# EAGLE design WatchMe-BASIC-TOP (EAGLE 9.6.2)
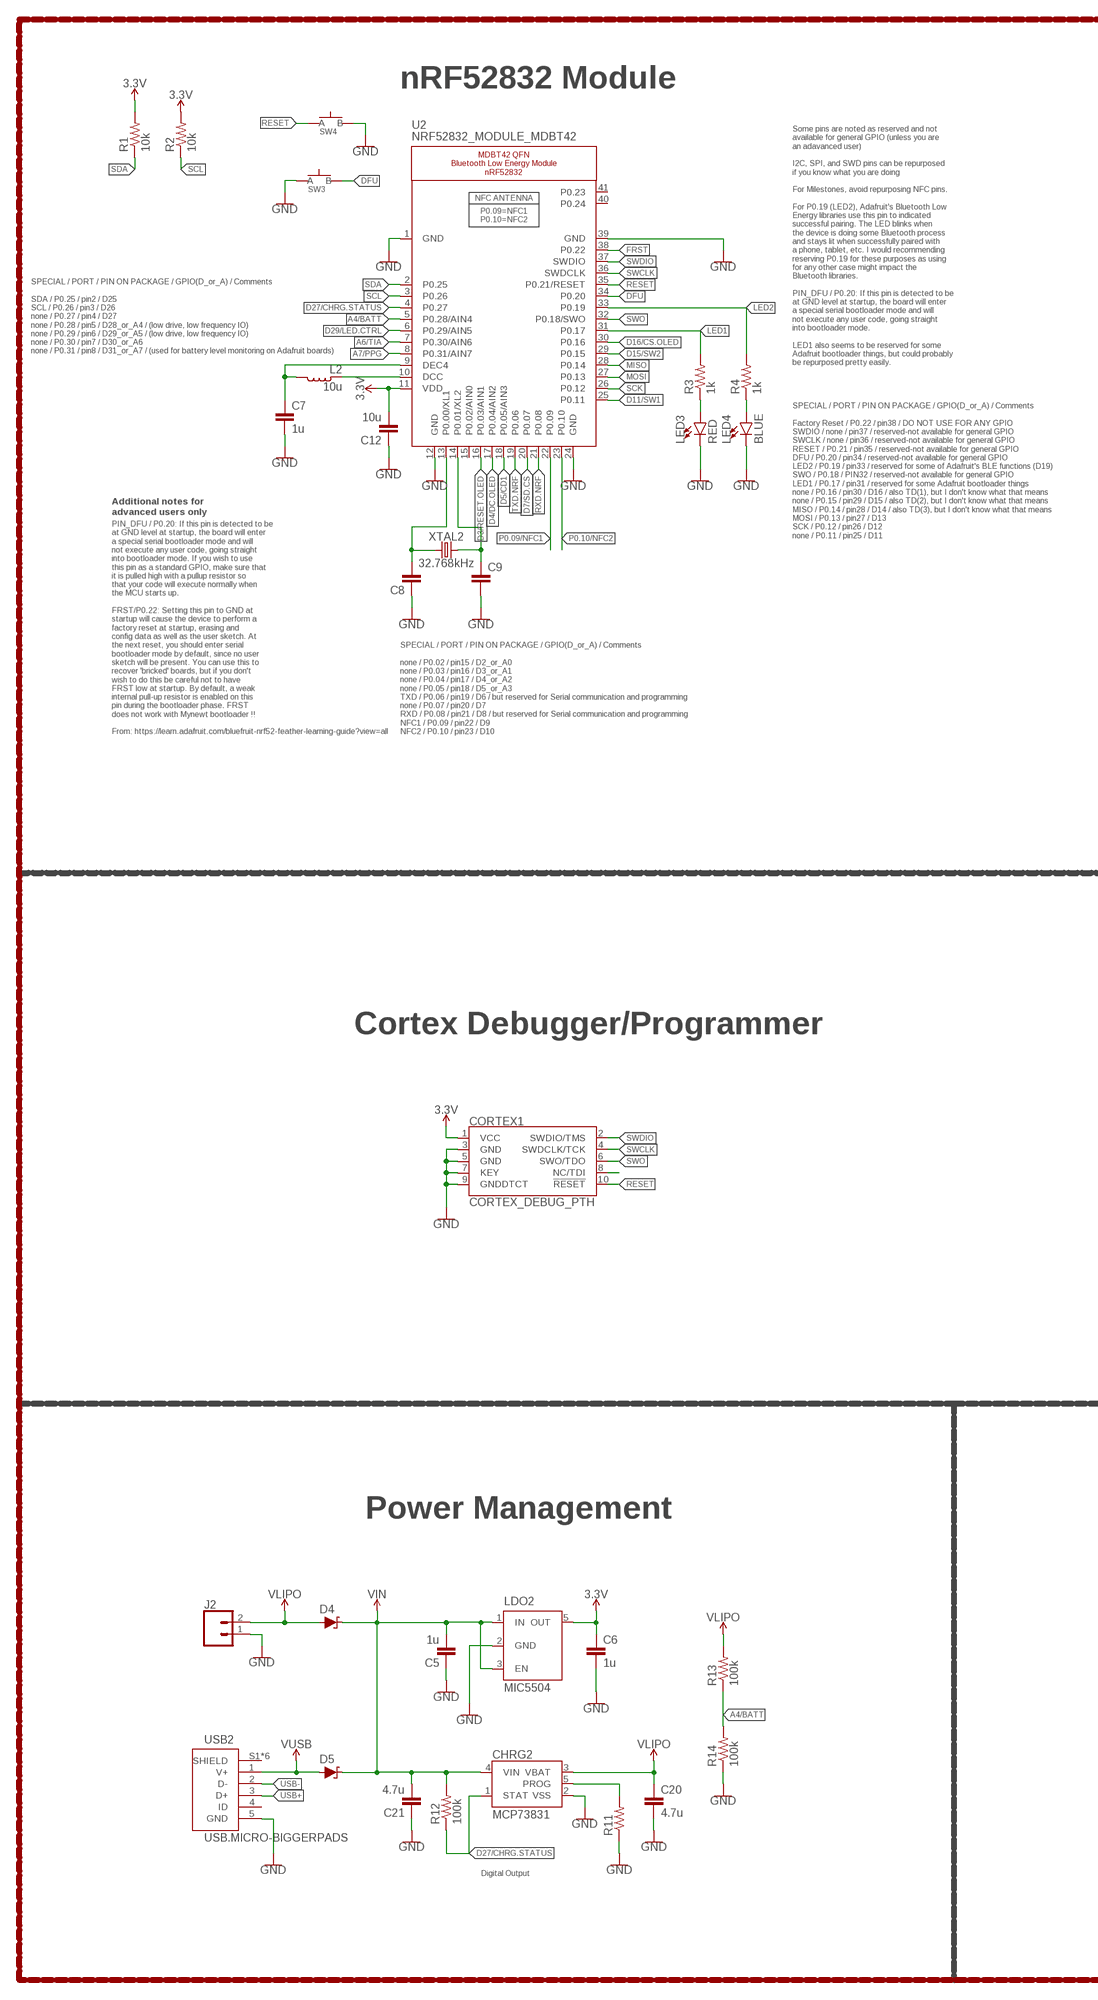
[diagram p0: schematic, sheet 1, part 1 of 2]
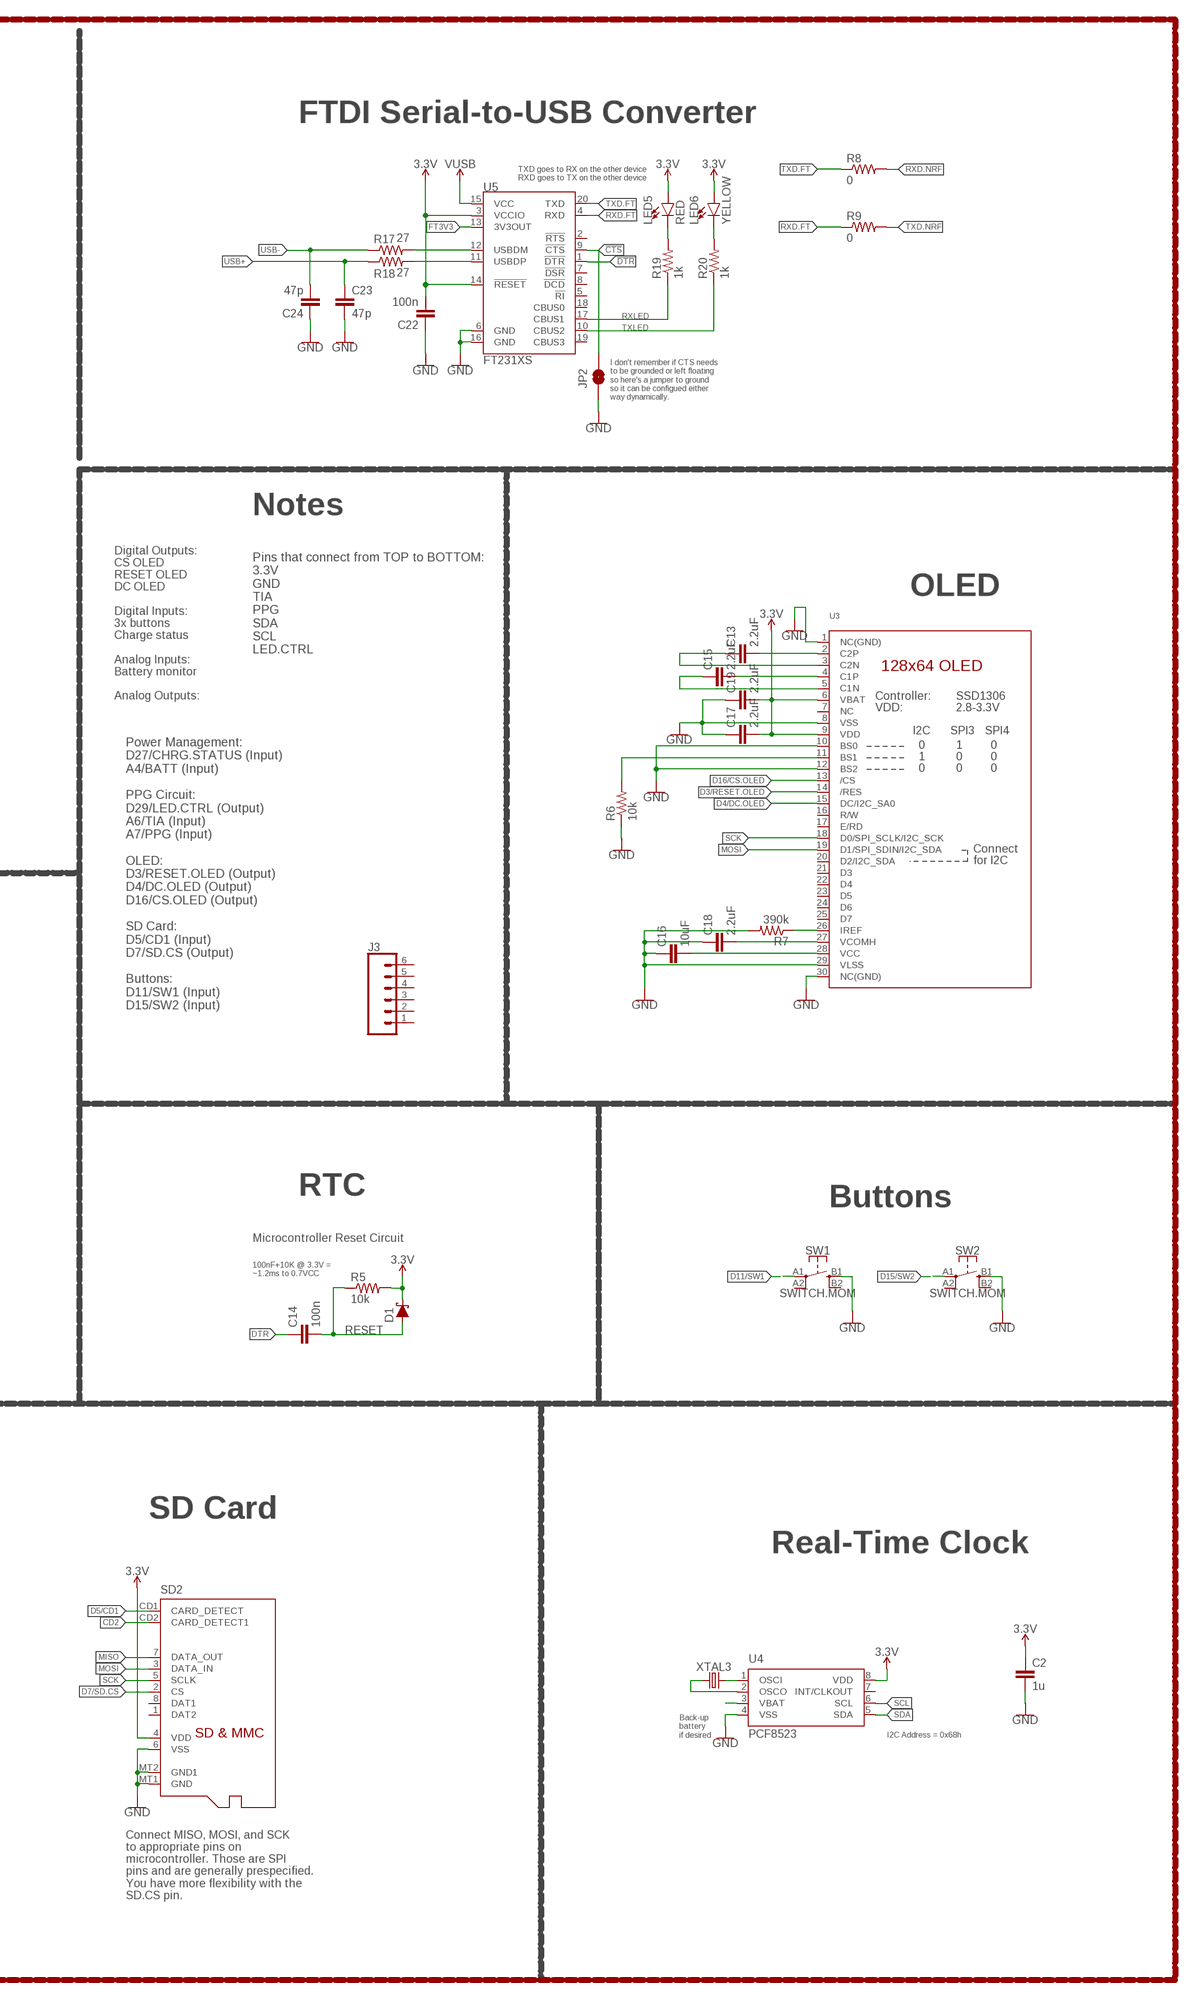
[diagram p1: schematic, sheet 1, part 2 of 2]

## Parts
C2  1u  CAPACITOR0603  [C0603]
C5  1u  CAPACITOR0603  [C0603]
C6  1u  CAPACITOR0603  [C0603]
C7  1u  CAPACITOR0603  [C0603]
C8  CAPACITOR0603  [C0603]
C9  CAPACITOR0603  [C0603]
C12  10u  CAPACITOR0805  [C0805]
C13  2.2uF  CAPACITOR0402  [C0402]
C14  100n  CAPACITOR0603  [C0603]
C15  2.2uF  CAPACITOR0402  [C0402]
C16  10uF  CAPACITOR0603  [C0603]
C17  2.2uF  CAPACITOR0402  [C0402]
C18  2.2uF  CAPACITOR0402  [C0402]
C19  2.2uF  CAPACITOR0402  [C0402]
C20  4.7u  CAPACITOR0603  [C0603]
C21  4.7u  CAPACITOR0603  [C0603]
C22  100n  CAPACITOR0603  [C0603]
C23  47p  CAPACITOR0603  [C0603]
C24  47p  CAPACITOR0603  [C0603]
CHRG2  MCP73831  [SOT23-5]
CORTEX1  CORTEX_DEBUG_PTH  [2X5-PTH-1.27MM]
D1  SCHOTTKY-USC  [USC]
D4  SCHOTTKY-USC  [USC]
D5  SCHOTTKY-USC  [USC]
J2  CONN_02  [1X02]
J3  CONN_061.27MM  [1X06_1.27MM]
JP2  JUMPER-SMT_2_NO_SILK  [SMT-JUMPER_2_NO_SILK]
L2  10u  INDUCTOR0603  [L0603]
LDO2  MIC5504  [SOT23-5]
LED3  RED  LED0603  [LED-0603]
LED4  BLUE  LED0603  [LED-0603]
LED5  RED  LED0603  [LED-0603]
LED6  YELLOW  LED0603  [LED-0603]
R1  10k  RESISTOR0603  [R0603]
R2  10k  RESISTOR0603  [R0603]
R3  1k  RESISTOR0603  [R0603]
R4  1k  RESISTOR0603  [R0603]
R5  10k  RESISTOR0603  [R0603]
R6  10k  RESISTOR0603  [R0603]
R7  390k  RESISTOR0603  [R0603]
R8  0  RESISTOR0603  [R0603]
R9  0  RESISTOR0603  [R0603]
R11  RESISTOR0603  [R0603]
R12  100k  RESISTOR0603  [R0603]
R13  100k  RESISTOR0603  [R0603]
R14  100k  RESISTOR0603  [R0603]
R17  27  RESISTOR0603  [R0603]
R18  27  RESISTOR0603  [R0603]
R19  1k  RESISTOR0603  [R0603]
R20  1k  RESISTOR0603  [R0603]
SD2  MICROSD  [MICROSD]
SW1  SWITCH.MOM  [TACTILE_SWITCH_SMD_6.2MM_TALL]
SW2  SWITCH.MOM  [TACTILE_SWITCH_SMD_6.2MM_TALL]
SW3  SPST-PTS830GG140-COPY.1-3  [BUTTON-GULLWING]
SW4  SPST-PTS830GG140-COPY.1-3  [BUTTON-GULLWING]
U2  NRF52832_MODULE_MDBT42  [BLE_MODULE_RAYTAC_MDBT42]
U3  DISP_OLED_UG-2864HSWEG01-NO-WRAPAROUND  [UG-2864HSWEG01_0.96IN_NO-WRAPAROUND]
U4  PCF8523  [SO8]
U5  FT231XS  [SSOP20_L]
USB2  USB.MICRO-BIGGERPADS  [USB-MICRO-01.BIGGERPADS]
XTAL2  32.768kHz  CRYSTALECS-.327-12.5-12-C-TR  [2-SMD.NOLEAD.2.0MMTO1.2MM]
XTAL3  32.7680kHz  CRYSTALECS-.327-12.5-12-C-TR  [2-SMD.NOLEAD.2.0MMTO1.2MM]

## Nets
3.3V: C2.1 C6.1 C12.2 C17.2 C19.2 C22.2 CORTEX1.1(VCC) D1.-(C) LDO2.5(OUT) LED5.A LED6.A R1.2 R2.2 R5.2 SD2.4(VDD) U2.11(VDD) U3.6(VBAT) U3.9(VDD) U4.8(VDD) U5.3(VCCIO) U5.14(!RESET)
!CTS: JP2.2 U5.9(!CTS)
!DTR: U5.1(!DTR)
A4/BATT: R13.1 R14.2 U2.5(P0.28/AIN4)
A6/TIA: U2.7(P0.30/AIN6)
A7/PPG: U2.8(P0.31/AIN7)
CD2: SD2.CD2(CARD_DETECT1)
D3/RESET.OLED: U2.16(P0.03/AIN1) U3.14(/RES)
D4/DC.OLED: U2.17(P0.04/AIN2) U3.15(DC/I2C_SA0)
D5/CD1: SD2.CD1(CARD_DETECT) U2.18(P0.05/AIN3)
D7/SD.CS: SD2.2(CS) U2.20(P0.07)
D11/SW1: SW1.A1 U2.25(P0.11)
D15/SW2: SW2.A1 U2.29(P0.15)
D16/CS.OLED: U2.30(P0.16) U3.13(/CS)
D27/CHRG.STATUS: CHRG2.1(STAT) R12.1 U2.4(P0.27)
D29/LED.CTRL: U2.6(P0.29/AIN5)
DFU: SW3.3(B) U2.34(P0.20)
DTR: C14.1
FRST: U2.38(P0.22)
FT3V3: U5.13(3V3OUT)
GND: C2.2 C5.1 C6.2 C7.2 C8.1 C9.2 C12.1 C16.1 C17.1 C18.1 C19.1 C20.2 C21.1 C22.1 C23.2 C24.1 CHRG2.2(VSS) CORTEX1.3(GND) CORTEX1.5(GND) CORTEX1.7(KEY) CORTEX1.9(GNDDTCT) J2.1 JP2.1 LDO2.2(GND) LED3.C LED4.C R6.1 R7.2 R11.1 R14.1 SD2.6(VSS) SD2.MT1(GND) SD2.MT2(GND1) SW1.B1 SW2.B1 SW3.1(A) SW4.3(B) U2.1(GND) U2.12(GND) U2.24(GND) U2.39(GND) U3.1(NC(GND)) U3.8(VSS) U3.10(BS0) U3.12(BS2) U3.29(VLSS) U3.30(NC(GND)) U4.4(VSS) U5.6(GND) U5.16(GND) USB2.5(GND)
LED1: R3.2 U2.31(P0.17)
LED2: R4.2 U2.33(P0.19)
MISO: SD2.7(DATA_OUT) U2.28(P0.14)
MOSI: SD2.3(DATA_IN) U2.27(P0.13) U3.19(D1/SPI_SDIN/I2C_SDA)
N$1: R6.2 U3.11(BS1)
N$2: R7.1 U3.26(IREF)
N$3: C13.2 U3.2(C2P)
N$4: C8.2 U2.13(P0.00/XL1) XTAL2.P$1
N$5: C13.1 U3.3(C2N)
N$6: C9.1 U2.14(P0.01/XL2) XTAL2.P$2
N$7: C15.2 U3.4(C1P)
N$8: C15.1 U3.5(C1N)
N$9: LED3.A R3.1
N$10: LED4.A R4.1
N$11: L2.1 U2.10(DCC)
N$12: C7.1 L2.2 U2.9(DEC4)
N$13: C16.2 U3.28(VCC)
N$14: CORTEX1.8(NC/TDI)
N$15: C18.2 U3.27(VCOMH)
N$17: CHRG2.5(PROG) R11.2
N$19: U4.2(OSCO) XTAL3.P$1
N$20: U4.1(OSCI) XTAL3.P$2
N$23: R17.2 U5.12(USBDM)
N$24: R18.2 U5.11(USBDP)
N$25: LED5.C R19.2
N$26: LED6.C R20.2
P0.09/NFC1: U2.22(P0.09)
P0.10/NFC2: U2.23(P0.10)
RESET: C14.2 CORTEX1.10(!RESET) D1.+(A) R5.1 SW4.1(A) U2.35(P0.21/RESET)
RXD.FT: R9.1 U5.4(RXD)
RXD.NRF: R8.2 U2.21(P0.08)
RXLED: R19.1 U5.17(CBUS1)
SCK: SD2.5(SCLK) U2.26(P0.12) U3.18(D0/SPI_SCLK/I2C_SCK)
SCL: R2.1 U2.3(P0.26) U4.6(SCL)
SDA: R1.1 U2.2(P0.25) U4.5(SDA)
SWCLK: CORTEX1.4(SWDCLK/TCK) U2.36(SWDCLK)
SWDIO: CORTEX1.2(SWDIO/TMS) U2.37(SWDIO)
SWO: CORTEX1.6(SWO/TDO) U2.32(P0.18/SWO)
TXD.FT: R8.1 U5.20(TXD)
TXD.NRF: R9.2 U2.19(P0.06)
TXLED: R20.1 U5.10(CBUS2)
USB+: C23.1 R18.1 USB2.3(D+)
USB-: C24.2 R17.1 USB2.2(D-)
V_USB: D5.+(A) U5.15(VCC) USB2.1(V+) ; supply symbol labelled VUSB
VBATT: U4.3(VBAT)
VIN: C5.2 C21.2 CHRG2.4(VIN) D4.-(C) D5.-(C) LDO2.1(IN) LDO2.3(EN) R12.2
VLIPO: C20.1 CHRG2.3(VBAT) D4.+(A) J2.2 R13.2
Unconnected: J3.1 J3.2 J3.3 J3.4 J3.5 J3.6 SD2.1(DAT2) SD2.8(DAT1) SW1.A2 SW1.B2 SW2.A2 SW2.B2 U2.15(P0.02/AIN0) U2.40(P0.24) U2.41(P0.23) U3.7(NC) U3.16(R/W) U3.17(E/RD) U3.20(D2/I2C_SDA) U3.21(D3) U3.22(D4) U3.23(D5) U3.24(D6) U3.25(D7) U4.7(INT/CLKOUT) U5.2(!RTS) U5.5(!RI) U5.7(!DSR) U5.8(!DCD) U5.18(CBUS0) U5.19(CBUS3) USB2.4(ID) USB2.S1(SHIELD) USB2.S2(SHIELD) USB2.S3(SHIELD) USB2.S4(SHIELD) USB2.S5(SHIELD) USB2.S6(SHIELD)

## Notes on the sheet
- nRF52832 Module
- FTDI Serial-to-USB Converter
- TXD goes to RX on the other device
  RXD goes to TX on the other device
- SPECIAL / PORT / PIN ON PACKAGE / GPIO(D_or_A) / Comments
  
  SDA / P0.25 / pin2 / D25
  SCL / P0.26 / pin3 / D26
  none / P0.27 / pin4 / D27
  none / P0.28 / pin5 / D28_or_A4 / (low drive, low frequency IO)
  none / P0.29 / pin6 / D29_or_A5 / (low drive, low frequency IO)
  none / P0.30 / pin7 / D30_or_A6
  none / P0.31 / pin8 / D31_or_A7 / (used for battery level monitoring on Adafruit boards)
- Some pins are noted as reserved and not
  available for general GPIO (unless you are
  an adavanced user)
  
  I2C, SPI, and SWD pins can be repurposed
  if you know what you are doing
  
  For Milestones, avoid repurposing NFC pins.
  
  For P0.19 (LED2), Adafruit's Bluetooth Low
  Energy libraries use this pin to indicated
  successful pairing. The LED blinks when
  the device is doing some Bluetooth process
  and stays lit when successfully paired with
  a phone, tablet, etc. I would recommending
  reserving P0.19 for these purposes as using
  for any other case might impact the
  Bluetooth libraries.
  
  PIN_DFU / P0.20: If this pin is detected to be
  at GND level at startup, the board will enter
  a special serial bootloader mode and will
  not execute any user code, going straight
  into bootloader mode.
  
  LED1 also seems to be reserved for some
  Adafruit bootloader things, but could probably
  be repurposed pretty easily.
- I don't remember if CTS needs
  to be grounded or left floating
  so here's a jumper to ground
  so it can be configued either
  way dynamically.
- Additional notes for
  advanced users only
- Notes
- SPECIAL / PORT / PIN ON PACKAGE / GPIO(D_or_A) / Comments
  
  Factory Reset / P0.22 / pin38 / DO NOT USE FOR ANY GPIO
  SWDIO / none / pin37 / reserved-not available for general GPIO
  SWCLK / none / pin36 / reserved-not available for general GPIO
  RESET / P0.21 / pin35 / reserved-not available for general GPIO
  DFU / P0.20 / pin34 / reserved-not available for general GPIO
  LED2 / P0.19 / pin33 / reserved for some of Adafruit's BLE functions (D19)
  SWO / P0.18 / PIN32 / reserved-not available for general GPIO
  LED1 / P0.17 / pin31 / reserved for some Adafruit bootloader things
  none / P0.16 / pin30 / D16 / also TD(1), but I don't know what that means
  none / P0.15 / pin29 / D15 / also TD(2), but I don't know what that means
  MISO / P0.14 / pin28 / D14 / also TD(3), but I don't know what that means
  MOSI / P0.13 / pin27 / D13
  SCK / P0.12 / pin26 / D12
  none / P0.11 / pin25 / D11
- OLED
- Pins that connect from TOP to BOTTOM:
  3.3V
  GND
  TIA
  PPG
  SDA
  SCL
  LED.CTRL
- Digital Outputs:
  CS OLED
  RESET OLED
  DC OLED
  
  Digital Inputs:
  3x buttons
  Charge status
  
  Analog Inputs:
  Battery monitor
  
  Analog Outputs:
- PIN_DFU / P0.20: If this pin is detected to be
  at GND level at startup, the board will enter
  a special serial bootloader mode and will
  not execute any user code, going straight
  into bootloader mode. If you wish to use
  this pin as a standard GPIO, make sure that
  it is pulled high with a pullup resistor so
  that your code will execute normally when
  the MCU starts up.
  
  FRST/P0.22: Setting this pin to GND at
  startup will cause the device to perform a
  factory reset at startup, erasing and
  config data as well as the user sketch. At
  the next reset, you should enter serial
  bootloader mode by default, since no user
  sketch will be present. You can use this to
  recover 'bricked' boards, but if you don't
  wish to do this be careful not to have
  FRST low at startup. By default, a weak
  internal pull-up resistor is enabled on this
  pin during the bootloader phase. FRST
  does not work with Mynewt bootloader !!
  
  From: https://learn.adafruit.com/bluefruit-nrf52-feather-learning-guide?view=all
- SPECIAL / PORT / PIN ON PACKAGE / GPIO(D_or_A) / Comments
  
  none / P0.02 / pin15 / D2_or_A0
  none / P0.03 / pin16 / D3_or_A1
  none / P0.04 / pin17 / D4_or_A2
  none / P0.05 / pin18 / D5_or_A3
  TXD / P0.06 / pin19 / D6 / but reserved for Serial communication and programming
  none / P0.07 / pin20 / D7
  RXD / P0.08 / pin21 / D8 / but reserved for Serial communication and programming
  NFC1 / P0.09 / pin22 / D9
  NFC2 / P0.10 / pin23 / D10
- Power Management:
  D27/CHRG.STATUS (Input)
  A4/BATT (Input)
  
  PPG Circuit:
  D29/LED.CTRL (Output)
  A6/TIA (Input)
  A7/PPG (Input)
  
  OLED:
  D3/RESET.OLED (Output)
  D4/DC.OLED (Output)
  D16/CS.OLED (Output)
  
  SD Card:
  D5/CD1 (Input)
  D7/SD.CS (Output)
  
  Buttons:
  D11/SW1 (Input)
  D15/SW2 (Input)
- Cortex Debugger/Programmer
- RTC
- Buttons
- Microcontroller Reset Circuit
- 100nF+10K @ 3.3V =
  ~1.2ms to 0.7VCC
- Power Management | SD Card
- Real-Time Clock
- Back-up
  battery
  if desired
- I2C Address = 0x68h
- Digital Output
- Connect MISO, MOSI, and SCK
  to appropriate pins on
  microcontroller. Those are SPI
  pins and are generally prespecified.
  You have more flexibility with the
  SD.CS pin.

## Library data of the parts
C2 C5-C9 C12-C24 = LinnesLab-Passives:CAPACITOR
CHRG2 = LinnesLab-Power:MCP73831: MCP73831T Li-Ion, Li-Pol Controller Miniature single cell, fully integrated Li-Ion, Li-polymer charge management controller Datasheet <http://ww1.microchip.com/downloads/en/DeviceDoc/20001984g.pdf> SparkFun Products: SparkFun ESP32 Thing <https://www.sparkfun.com/products/13907> SparkFun 9DoF Razor IMU M0 <https://www.sparkfun.com/products/14001>; PROD_ID: IC-09995
CORTEX1 = LinnesLab-Connectors:CORTEX_DEBUG: Cortex Debug Connector - 10 pin Supports JTAG debug, Serial Wire debug, and Serial Wire Viewer. PTH and SMD connector options available. General Connector Information <http://infocenter.arm.com/help/topic/com.arm.doc.faqs/attached/13634/cortex_debug_connectors.pdf> Products: PTH Connector <http://www.digikey.com/product-detail/en/cnc-tech/3220-10-0100-00/1175-1627-ND/3883661> -via Digi-Key SparkFun PSoc <https://www.sparkfun.com/products/13229> SparkFun T <https://www.sparkfun.com/products/13810>
D1 D4 D5 = LinnesLab-DiscreteSemi:SCHOTTKY: Schottky diode A Schottky diode is a semiconductor diode which has a low forward voltage drop and a very fast switching action. Example: Digi-Key Part Number: RB161MM-20CT-ND
J2 = LinnesLab-Connectors:CONN_02: Multi connection point. Often used as Generic Header-pin footprint for 0.1 inch spaced/style header connections On any of the 0.1 inch spaced packages, you can populate with these: Break Away Headers - Straight (PRT-00116) Break Away Male Headers - Right Angle (PRT-00553) Female Headers (PRT-00115) Break Away Headers - Machine Pin (PRT-00117) Break Away Female Headers - Swiss Machine Pin (PRT-00743) For SCREWTERMINALS and SPRING TERMINALS visit here: Screw Terimnals on SparkFun.com (5mm/3.5mm/2.54mm spacing) This device is also useful as a general connection point to wire up your design to another part of your project. Our various solder wires solder well into these plated through hole pads. Hook-Up Wire - Assortment (Stranded, 22 AWG) (PRT-11375) Hook-Up Wire - Assortment (Solid Core, 22 AWG) (PRT-11367) View the entire wire category on our website here Special notes: Molex polarized connector foot print use with: PRT-08233 with associated crimp pins and housings. 2.54_SCREWTERM for use with PRT-10571. 3.5mm Screw Terminal footprints for PRT-08084 5mm Screw Terminal footprints for use with PRT-08432
J3 = LinnesLab-Connectors:CONN_06: Multi connection point. Often used as Generic Header-pin footprint for 0.1 inch spaced/style header connections On any of the 0.1 inch spaced packages, you can populate with these: Break Away Headers - Straight (PRT-00116) Break Away Male Headers - Right Angle (PRT-00553) Female Headers (PRT-00115) Break Away Headers - Machine Pin (PRT-00117) Break Away Female Headers - Swiss Machine Pin (PRT-00743) Arduino Stackable Header - 6 Pin (PRT-09280) For SCREWTERMINALS and SPRING TERMINALS visit here: Screw Terimnals on SparkFun.com (5mm/3.5mm/2.54mm spacing) This device is also useful as a general connection point to wire up your design to another part of your project. Our various solder wires solder well into these plated through hole pads. Hook-Up Wire - Assortment (Stranded, 22 AWG) (PRT-11375) Hook-Up Wire - Assortment (Solid Core, 22 AWG) (PRT-11367) View the entire wire category on our website here
JP2 = LinnesLab-Switches:JUMPER-SMT_2_NO: Normally open jumper This jumper has two pads in close proximity to each other. Apply solder to close the connection. Round pads are easier to solder for beginners, but are a lot larger. SparkFun Product that uses the round pads: SparkFun EL Sequencer
L2 = LinnesLab-Passives:INDUCTOR
LDO2 = LinnesLab-Power:MIC5504: MIC5504 Voltage Regulator Output Voltages: 1.0V to 3.3V Input Voltages: 2.5V to 5.5V Link to Datasheet http://ww1.microchip.com/downloads/en/DeviceDoc/MIC550X.pdf
LED3-LED6 = LinnesLab-LED:LED: LED (Generic) Standard schematic elements and footprints for 5mm, 3mm, 1206, and 0603 sized LEDs. Generic LEDs with no color specified. LTST-C190KGKT: arrow indicates cathode
R1-R9 R11-R14 R17-R20 = LinnesLab-Passives:RESISTOR
SD2 = LinnesLab-Connectors:MICROSD: Micro-SD / Transflash card holder with SPI pinout For the 3M # 2908-05WB-MG and/or 4UCON #19656 push-push type
SW1 SW2 = LinnesLab-Switches:SWITCH.MOM: PTS645SM43SMTR92 LFS
SW3 SW4 = LinnesLab-Switches:SPST-PTS830GG140-COPY
U2 = LinnesLab-Microcontrollers:NRF52832_MODULE_MDBT42: MDBT42 - BLE Module (nRF52832 QFN) VDD: 1.7-3.6V
U3 = LinnesLab-Displays:DISP_OLED_UG-2864HSWEG01: UG-2864HSWEG01 OLED display Both 1.3" and 0.96" models share the same FPC tab footprint, only the screen dimensions vary.
U4 = LinnesLab-Clocks:PCF8523; DIGIKEY: 568-5306-1-ND; I2C_ADDRESS: 0x68h; MFN: PCF8523T/1,118; MFN_MANUFACTURER: NXP USA Inc.
U5 = LinnesLab-DigitalIC:FT231X: FTDI FT231X Full Speed USB to Full-handshake UART This USB2.0 Full Speed IC offers a compact bridge to full handshake UART interfaces. The device is a UART, capable of operating up to 3MBaud, with low power consumption (8mA). The FT231X includes the complete FT-X series feature set and enables USB to be added into a system design quickly and easily over a UART interface. Datasheet; DIGIKEY: 768-1156-5-ND; MFN: FT231XS-U
USB2 = LinnesLab-Connectors:USB.MICRO: DigiKey PN: 609-4613-1-ND
XTAL2 XTAL3 = LinnesLab-Clocks:CRYSTAL; DIGIKEY: XC2288CT-ND; FREQ: 32.7680KHZ; LOAD_CAP: 12.5pF

## Board
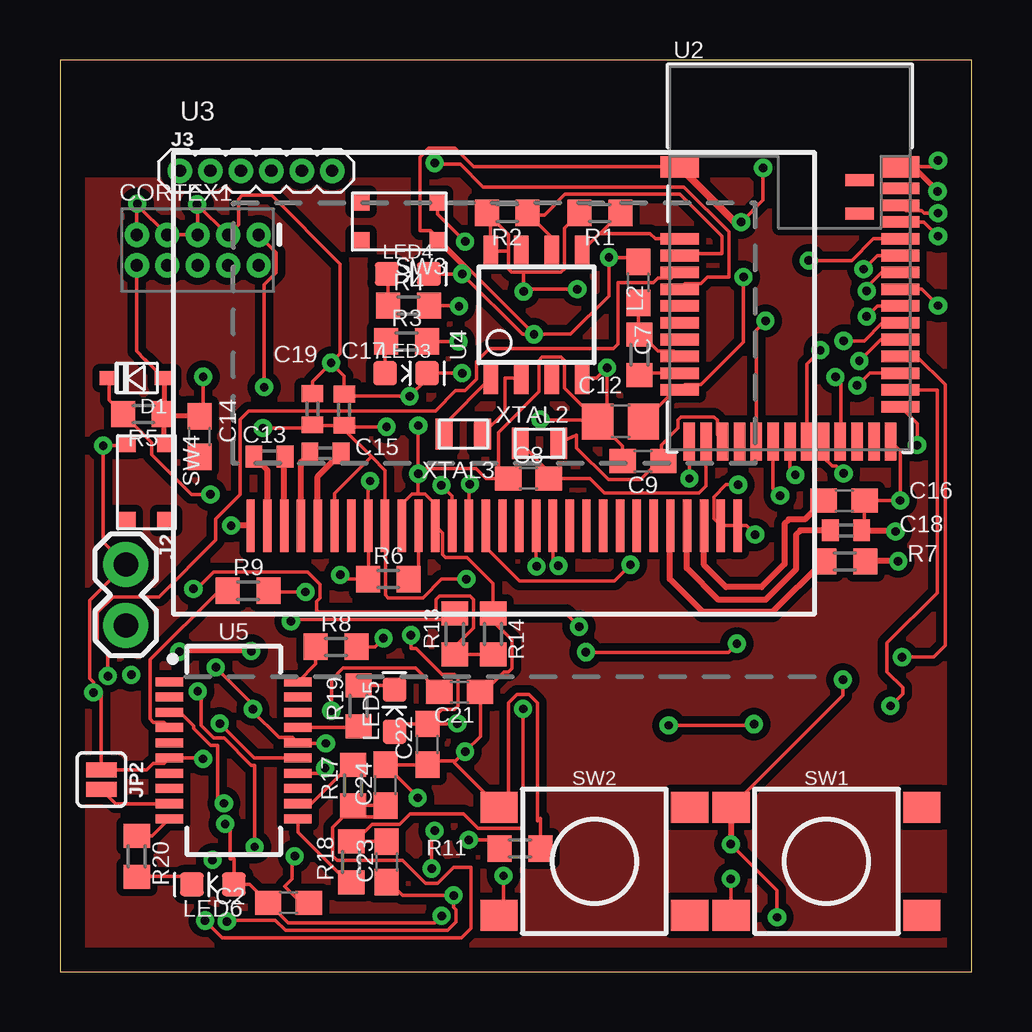
[diagram p2: board, top side]
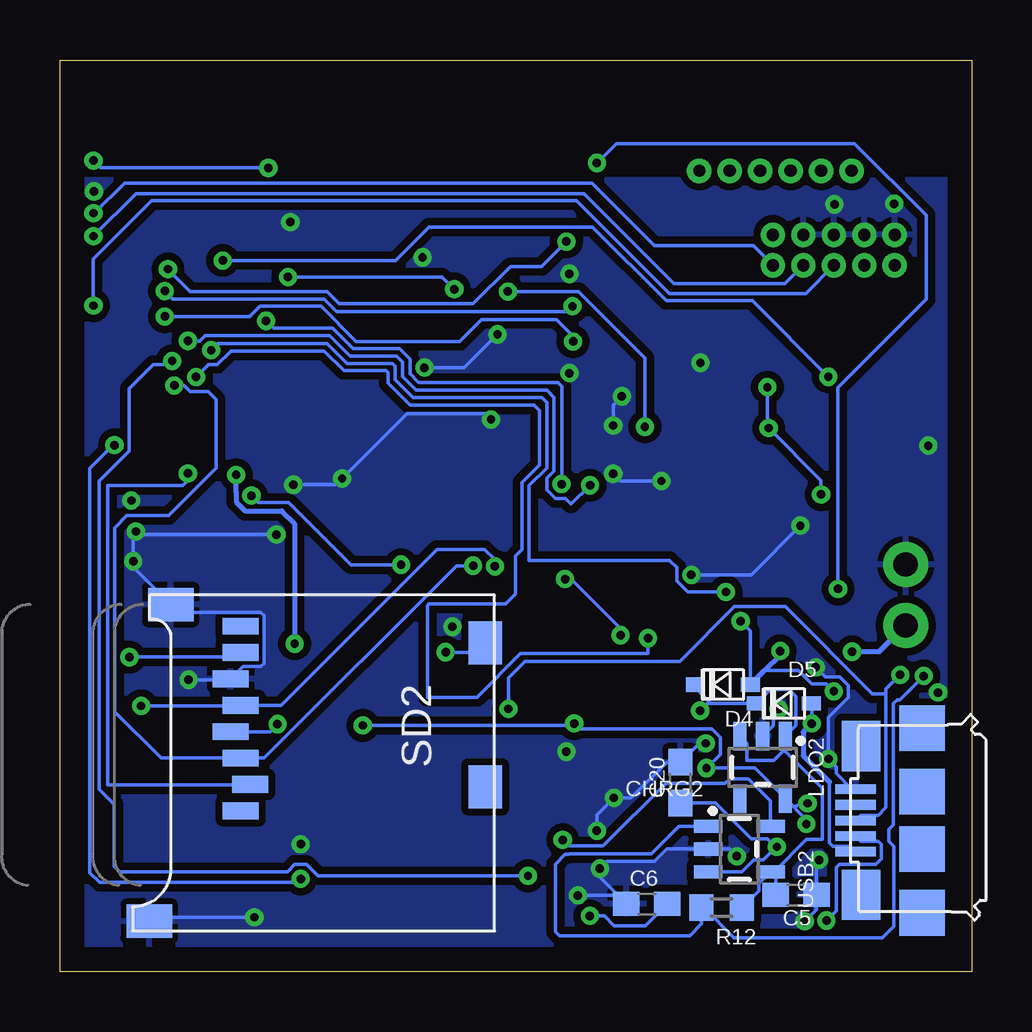
[diagram p3: board, bottom side, seen from below]

Size 38 x 38 mm. Coordinates in mm from the lower left corner, seen from the top.
Outline: 0,0 38,0 38,38 0,38 0,0
Copper layers (1*16): Top 0.035mm / dielectric 1.5mm / Bottom 0.035mm
Design rules "default": minimum track width 6mil, minimum drill 0.35mm, track to track 6mil, track to pad 6mil, pad to pad 6mil, via to via 6mil, smd to smd 6mil, copper to edge 40mil, drill to drill 6mil, minimum pad ring 10mil, minimum via ring 8mil, stop-mask expansion 4mil, vias tented up to drill 0mil, thermal gap 10mil

### Footprints (pad centres in the part's own frame; a part is rotated, then mirrored left to right if it is on the bottom)
C0603 = smd 1.1 x 1: 1 -0.85,0; 2 0.85,0
C0805 = smd 1.3 x 1.5: 1 -0.95,0; 2 0.95,0
C0402 = smd 0.7 x 0.9: 1 -0.65,0; 2 0.65,0
SOT23-5 = smd 0.55 x 1.2: 1 -0.95,-1.3; 2 0,-1.3; 3 0.95,-1.3; 4 0.95,1.3; 5 -0.95,1.3
2X5-PTH-1.27MM = drill 0.508 pad 1: 1 -2.54,-0.635; 2 -2.54,0.635; 3 -1.27,-0.635; 4 -1.27,0.635; 5 0,-0.635; 6 0,0.635; 7 1.27,-0.635; 8 1.27,0.635; 9 2.54,-0.635; 10 2.54,0.635
USC = smd 0.8 x 0.6: + -1.15,0; - 1.15,0
1X02 = drill 1.016 pad 1.88: 1 0,0; 2 2.54,0
1X06_1.27MM = drill 0.508 pad 1: 1 0,0; 2 1.27,0; 3 2.54,0; 4 3.81,0; 5 5.08,0; 6 6.35,0
SMT-JUMPER_2_NO_SILK = smd 0.635 x 1.27: 1 -0.406,0; 2 0.406,0
L0603 = smd 1 x 1.1: 1 -0.85,0; 2 0.85,0
LED-0603 = smd 1 x 1: A -0.877,0; C 0.877,0
R0603 = smd 1 x 1.1: 1 -0.85,0; 2 0.85,0
MICROSD = smd 0.7 x 1.5: 1 9,-10.64; 2 7.9,-10.24; 3 6.8,-10.64; 4 5.7,-11.04; 5 4.6,-10.64; 6 3.5,-11.04; 7 2.4,-10.64; 8 1.3,-10.64 | smd 1.8 x 1.4: CD1 2,-0.44; CD2 8,-0.44 | smd 1.4 x 1.9: MT1 0.4,-13.54; MT2 13.6,-14.44
TACTILE_SWITCH_SMD_6.2MM_TALL = smd 1.55 x 1.3: A1 -3.975,-2.25; A2 3.975,-2.25; B1 -3.975,2.25; B2 3.975,2.25
BUTTON-GULLWING = smd 0.7 x 0.75: 1 -1.6,0.825; 2 1.6,0.825; 3 -1.6,-0.825; 4 1.6,-0.825
BLE_MODULE_RAYTAC_MDBT42 = smd 1.6 x 0.9: 1 -4.6,3.8; 39 4.6,3.8 | smd 1.6 x 0.48: 2 -4.6,0.8; 3 -4.6,0.1; 4 -4.6,-0.6; 5 -4.6,-1.3; 6 -4.6,-2; 7 -4.6,-2.7; 8 -4.6,-3.4; 9 -4.6,-4.1; 10 -4.6,-4.8; 11 -4.6,-5.5; 25 4.6,-6.2; 26 4.6,-5.5; 27 4.6,-4.8; 28 4.6,-4.1; 29 4.6,-3.4; 30 4.6,-2.7; 31 4.6,-2; 32 4.6,-1.3; 33 4.6,-0.6; 34 4.6,0.1; 35 4.6,0.8; 36 4.6,1.5; 37 4.6,2.2; 38 4.6,2.9 | smd 0.48 x 1.6: 12 -4.2,-7.65; 13 -3.5,-7.65; 14 -2.8,-7.65; 15 -2.1,-7.65; 16 -1.4,-7.65; 17 -0.7,-7.65; 18 0,-7.65; 19 0.7,-7.65; 20 1.4,-7.65; 21 2.1,-7.65; 22 2.8,-7.65; 23 3.5,-7.65; 24 4.2,-7.65 | smd 1.2 x 0.5: 40 2.9,3.25; 41 2.9,1.85
UG-2864HSWEG01_0.96IN_NO-WRAPAROUND = smd 0.35 x 2.2: 1 -10.15,-1.2; 2 -9.45,-1.2; 3 -8.75,-1.2; 4 -8.05,-1.2; 5 -7.35,-1.2; 6 -6.65,-1.2; 7 -5.95,-1.2; 8 -5.25,-1.2; 9 -4.55,-1.2; 10 -3.85,-1.2; 11 -3.15,-1.2; 12 -2.45,-1.2; 13 -1.75,-1.2; 14 -1.05,-1.2; 15 -0.35,-1.2; 16 0.35,-1.2; 17 1.05,-1.2; 18 1.75,-1.2; 19 2.45,-1.2; 20 3.15,-1.2; 21 3.85,-1.2; 22 4.55,-1.2; 23 5.25,-1.2; 24 5.95,-1.2; 25 6.65,-1.2; 26 7.35,-1.2; 27 8.05,-1.2; 28 8.75,-1.2; 29 9.45,-1.2; 30 10.15,-1.2
SO8 = smd 1.3 x 0.6: 1 -2.65,1.905; 2 -2.65,0.635; 3 -2.65,-0.635; 4 -2.65,-1.905; 5 2.65,-1.905; 6 2.65,-0.635; 7 2.65,0.635; 8 2.65,1.905
SSOP20_L = smd 0.381 x 1.143: 1 -2.857,-2.68; 2 -2.223,-2.68; 3 -1.587,-2.68; 4 -0.953,-2.68; 5 -0.318,-2.68; 6 0.318,-2.68; 7 0.953,-2.68; 8 1.587,-2.68; 9 2.223,-2.68; 10 2.857,-2.68; 11 2.857,2.68; 12 2.223,2.68; 13 1.587,2.68; 14 0.953,2.68; 15 0.318,2.68; 16 -0.318,2.68; 17 -0.953,2.68; 18 -1.587,2.68; 19 -2.223,2.68; 20 -2.857,2.68
USB-MICRO-01.BIGGERPADS = smd 0.4 x 1.7: 1 -1.3,1.505; 2 -0.65,1.505; 3 0,1.505; 4 0.65,1.505; 5 1.3,1.505 | smd 1.9 x 1.9: S1 -3.85,-1.27; S2 -1.2,-1.27; S3 1.2,-1.27; S4 3.85,-1.27 | smd 2.1 x 1.6: S5 -3.1,1.28; S6 3.1,1.28
2-SMD.NOLEAD.2.0MMTO1.2MM = smd 0.7 x 1.3: P$1 -0.8,0; P$2 0.8,0

### Placement (x,y rotation side)
C2  9.53,2.87 0 top
C5  7.32,3.2 180 bottom
C6  13.54,2.82 180 bottom
C7  24.1,28.73 90 top
C8  19.53,20.55 0 top
C9  24.31,21.29 180 top
C12  23.37,22.94 0 top
C13  8.73,21.47 180 top
C14  5.82,22.3 90 top
C15  11.06,21.61 180 top
C16  32.69,19.63 180 top
C17  11.85,23.42 270 top
C18  32.77,18.39 180 top
C19  10.53,23.44 270 top
C20  12.14,7.87 90 bottom
C21  16.66,11.66 180 top
C22  15.32,9.47 90 top
C23  13.61,4.57 270 top
C24  13.56,7.77 270 top
CHRG2  9.68,5.11 270 bottom
CORTEX1  5.74,30.07 180 top
D1  3.2,24.74 180 top
D4  10.36,11.96 180 bottom
D5  7.82,11.18 180 bottom
J2  2.74,16.97 270 top
J3  5,33.38 0 top
JP2  1.73,8 270 top
L2  24.16,25.7 90 top
LDO2  8.71,8.51 180 bottom
LED3  14.43,24.94 0 top
LED4  14.5,29.08 0 top
LED5  13.94,10.87 90 top
LED6  6.38,3.63 180 top
R1  22.5,31.62 180 top
R2  18.64,31.62 180 top
R3  14.45,26.26 0 top
R4  14.53,27.76 0 top
R5  3.48,23.24 180 top
R6  13.69,16.36 0 top
R7  32.72,17.09 0 top
R8  11.51,13.54 0 top
R9  7.85,15.88 0 top
R11  19.18,5.13 180 top
R12  10.41,2.67 0 bottom
R13  16.46,14.07 90 top
R14  18.06,14.07 270 top
R17  12.22,7.77 90 top
R18  12.14,4.57 270 top
R19  12.45,11.07 90 top
R20  3.2,4.8 270 top
SD2  19.84,15.7 270 bottom
SW1  31.95,4.6 0 top
SW2  22.28,4.6 0 top
SW3  14.15,31.27 180 top
SW4  3.61,20.4 270 top
U2  30.43,29.74 0 top
U3  18.1,19.79 0 top
U4  19.86,27.38 90 top
U5  7.24,9.22 270 top
USB2  3.33,6.3 90 bottom
XTAL2  19.99,22.02 0 top
XTAL3  16.81,22.4 180 top

### Tracks (layer width: path | path; a pad name or v marks a point on that pad's centre or on a via)
3.3V  (via drill 0.35)
  Top 0.152: C12.2 25.62,24.24 U2.11 26.06,24.48 26.72,24.48 28.5,26.25 v28.5,28.95 | C17.2 11.85,22.59 12.98,21.46 | U3.6 11.45,19.93 12.98,21.46 | 12.98,21.46 13.55,20.89 U3.9 13.57,18.56 13.57,15.69 13.68,15.58 15.13,15.58 15.91,16.36 v16.94,16.36 | D1.- 2.05,23.82 R5.2 3.83,22.04 3.83,21.55 5.49,19.89 v6.27,19.89 | 18.7,29.97 18.7,30.72 R2.2 17.96,31.46 U4.8 18.64,30.03 18.7,29.97 | 18.7,29.97 18.7,29.29 18.83,29.15 19.33,29.15 | 19.33,29.15 20.89,29.15 21.03,29.29 21.03,31 R1.2 | C17.2 10.55,22.77 C19.2 10.39,22.66 v8.46,22.66 | LED5.A 14.28,10.32 C22.2 | C22.2 16.55,10.32 v16.56,10.34 | U5.14 10.89,8.27 11.05,8.43 v11.05,8.48 | v6.89,6.15 7.09,5.95 7.09,4.69 7.25,4.69 LED6.A 7.91,3.63 C2.1 9.51,2.04 15.63,2.04 v15.91,2.32 | v8.51,24.36 8.51,28.62 9.02,29.13 9.02,29.97 CORTEX1.1 | v25.38,10.26 28.88,10.26 v28.93,10.31 | C17.2 11.91,22.71 v13.61,22.71 | 19.33,29.15 v19.33,28.35 19.43,28.44 v21.57,28.44 | v6.83,7.01 6.58,7.26 6.58,9.43 6.28,9.43 5.57,10.14 5.57,10.25 5.01,10.81 U5.3 | C22.2 15.92,10.93 16.46,10.93 16.59,11.06 16.59,12.25 16.46,12.39 15.92,12.39 14.85,13.46 14.63,13.46 | 14.63,13.46 | 14.63,13.46 v14.63,14.02
  Bottom 0.152: v6.27,19.89 6.27,20.47 v8.46,22.66 8.51,22.71 v8.51,24.36 | v25.38,10.26 16.64,10.26 v16.56,10.34 16.34,10.12 10.83,10.12 10.48,9.76 10.48,9.06 v11.05,8.48 9.03,8.48 LDO2.5 | v28.93,10.31 29.25,10 SD2.4 | v19.33,28.35 v19.33,28.34 16.39,28.34 13.61,25.57 v13.61,22.71 | v14.63,14.02 14.63,14.3 16.69,16.36 v16.94,16.36 | v21.57,28.44 22.07,28.95 v28.5,28.95 | v15.91,2.32 15.31,2.32 14.91,1.91 13.6,1.91 C6.1 | LDO2.5 7.44,6.88 7.29,6.88 7.17,7.01 v6.83,7.01 | v6.89,6.15 6.89,6.33 LDO2.5
9V
  pour Top (isolate 0.305): 0.21,32.99 37.71,32.99 37.71,0.24 0.21,0.24
!CTS
  Top 0.152: U5.9 2.32,7 JP2.2
A4/BATT  (via drill 0.35)
  Top 0.152: v5.56,15.95 5.7,15.95 6.4,16.65 10.33,16.65 10.84,16.14 10.84,15.57 10.69,15.42 10.69,14.99 15.54,14.99 15.68,15.12 15.68,15.52 15.81,15.65 17.1,15.65 17.24,15.52 17.24,14.33 16.46,13.55 R13.1 R14.2 | v15.62,33.71 15.67,33.66 16.69,33.66 17.64,32.71 26.02,32.71 27.89,30.84 27.89,28.95 27,28.95 26.72,28.68 26.06,28.68 U2.5
  Bottom 0.152: v5.56,15.95 5.56,24.34 1.88,28.02 1.88,31.52 4.88,34.52 14.81,34.52 v15.62,33.71
D3/RESET.OLED  (via drill 0.35)
  Top 0.152: U2.16 29.03,26.74 v29.41,27.13 | v17.09,20.32 17.05,20.28 U3.14
  Bottom 0.152: v29.41,27.13 29.1,26.81 26.64,26.81 25.78,25.96 23.85,25.96 23.42,25.52 23.42,24.92 23.06,24.56 17.24,24.56 17.07,24.39 17.07,20.37 17.12,20.32 v17.09,20.32
D4/DC.OLED  (via drill 0.35)
  Top 0.152: v23.78,16.96 23.11,16.28 19.15,16.28 17.75,17.69 U3.15 | U2.17 29.72,22.08 29.72,20.14 v30.02,19.84
  Bottom 0.152: v23.78,16.96 25.86,16.96 28.46,19.56 29.74,19.56 v30.02,19.84
D5/CD1  (via drill 0.35)
  Top 0.152: v21.92,13.31 27.86,13.31 v28.22,13.66 | v30.66,20.7 30.43,20.93 U2.18
  Bottom 0.152: v21.92,13.31 20.66,13.31 SD2.CD1
  Bottom 0.203: v28.22,13.66 28.22,18.67 28.75,19.2 30.29,19.2 30.66,19.58 30.66,19.96 v30.66,20.7
D7/SD.CS  (via drill 0.35)
  Top 0.152: v32.66,20.76 32.36,21.07 32.2,21.07 31.83,21.43 U2.20
  Bottom 0.152: SD2.2 30.1,7.77 36.02,7.77 36.02,20.27 32.89,20.27 32.66,20.49 v32.66,20.76
D11/SW1  (via drill 0.35)
  Top 0.152: SW1.A1 27.98,3.85 v27.96,3.86 | U2.25 35.73,22.84 v35.73,21.95
  Bottom 0.152: v35.73,21.95 35.78,21.95 36.75,20.97 36.75,4.12 36.35,3.71 28.12,3.71 v27.96,3.86
D15/SW2  (via drill 0.35)
  Top 0.152: SW2.A1 18.49,2.54 v18.49,3.99 | v33.33,25.45 34.22,26.34 U2.29
  Bottom 0.152: v18.49,3.99 27.23,3.99 27.71,4.47 28.22,4.47 28.52,4.17 35.51,4.17 35.74,4.39 35.74,6.96 36.37,7.59 36.37,20.45 35.12,21.69 35.12,24.29 34.12,25.3 33.47,25.3 v33.33,25.45
D16/CS.OLED  (via drill 0.35)
  Top 0.152: U2.30 34.28,27.04 33.53,26.29 v32.66,26.29 | U3.13 16.35,19.82 v15.9,20.27
  Bottom 0.152: v15.9,20.27 16.69,19.48 16.92,19.71 17.34,19.71 17.7,20.07 17.7,20.57 17.4,20.87 17.4,23.93 17.7,24.23 23.16,24.23 23.72,24.79 23.72,25.4 23.98,25.65 25.91,25.65 26.76,26.51 31.95,26.51 32.17,26.29 v32.66,26.29
D27/CHRG.STATUS  (via drill 0.35)
  Top 0.152: U2.4 25.73,29.14 25.5,28.91 24.93,28.91 24.75,28.73 23.27,28.73 23.27,26.16 23.06,25.96 17.91,25.96 17.37,25.42 17.37,24.69 16.89,24.21 16.5,24.21 15.65,23.37 7.87,23.37 7.5,23 7.5,19.88 6.5,18.87 6.5,17.98 4.13,15.62 2.21,15.62 1.55,14.96 1.55,13.74 1.99,13.3 v1.99,12.32
  Bottom 0.152: v1.99,12.32 2.98,11.33 3.1,11.33 3.25,11.18 3.25,6.12 3.45,5.92 3.45,5.43 3.25,5.22 3.25,1.88 3.71,1.42 9.91,1.42 11.17,2.67 R12.1 11.26,1.98 11.75,1.5 17.19,1.5 17.34,1.65 17.34,3.2 17.35,3.2 17.35,4.47 16.94,4.88 16.79,4.88 16.77,4.91 13.35,4.91 12.2,6.05 CHRG2.1
DFU  (via drill 0.35)
  Top 0.152: v33.5,29.28 34.06,29.84 U2.34 | v16.89,30.43 15.75,31.57 SW3.3
  Bottom 0.152: v16.89,30.43 17.93,29.39 19.23,29.39 20.78,27.84 26.36,27.84 26.87,28.34 32.57,28.34 v33.5,29.28
GND  (via drill 0.35)
  Top 0.152: 16.5,8.78 v16.89,9.17 17.53,9.8 17.53,11.51 | 16.5,8.78 15.47,8.78 C22.1 C24.1 14.91,7.28 v14.91,7.24 | 16.5,8.78 16.45,8.73 16.45,8.7 SW2.B1 18.7,7.24 18.7,11.2 19.05,11.55 19.56,11.55 19.91,11.2 19.91,6.28 20.03,6.39 R11.1 | v11.68,16.54 11.86,16.36 R6.1 12.87,16.38 12.87,18.57 U3.8 12.85,20.36 v12.93,20.45 | SW4.3 2.71,21.92 v1.8,21.92 1.8,17.91 J2.1 1.25,15.47 1.25,12.21 1.4,12.06 v1.4,11.63 1.73,11.63 JP2.1 3.61,8.41 3.89,8.69 4.34,8.69 U5.6 5.92,8.9 v5.96,8.87 | C21.1 17.53,11.64 17.53,11.51 | R14.1 18.06,16.17 16.98,17.26 16.08,17.26 15.94,17.39 15.94,18.29 U3.12 15.65,19.48 15.22,19.91 14.88,19.91 | R14.1 21.1,14.92 v21.64,14.38 | LED4.C v16.76,29.08 | v16.76,24.94 LED3.C 15.3,24.7 v14.58,23.98 11.95,23.98 C17.1 | SW3.1 16.76,29.43 v16.76,29.08 | C19.1 10.53,24.6 v11.3,25.38 | C17.1 | C17.1 11.85,24.83 v11.3,25.38 | v14.94,20.75 15.16,20.98 17.34,20.98 17.77,20.55 C8.1 18.27,20.96 18.27,22.48 19.97,24.18 19.97,25.48 20.1,25.61 20.89,25.61 21.03,25.48 21.03,24.33 C12.1 | v11.08,9.51 9.94,9.51 U5.16 9.7,9.75 9.14,9.75 8.04,10.85 v8.04,10.94 8.04,11.14 v6.49,12.68 | U4.4 22.37,24.73 v22.81,25.17 22.8,25.16 22.8,23.32 C12.1 | CORTEX1.9 3.2,31.98 v3.23,32 3.23,31.95 CORTEX1.7 CORTEX1.5 5.74,31.95 v5.71,31.98 6.99,30.71 CORTEX1.3 7.44,31.14 7.44,32.21 7.59,32.36 8.81,32.36 11.68,29.49 11.68,25.76 v11.3,25.38 | v28.98,18.21 28.61,18.59 U3.30 U3.29 27.25,18.88 27.25,19.78 27.76,20.3 v28.27,20.3 | U2.24 35.03,21.7 v35.03,19.63 C16.1 33.54,18.51 C18.1 | C7.2 23.91,29.77 v22.89,29.77 22.89,28.17 21.29,26.57 v19.76,26.57 | v26.24,20.55 U2.12 | v14.94,20.75 v14.94,22.76
  Top 0.152: v32.64,12.17 32.64,11.51 27.96,6.83 | v27.96,5.31 29.9,3.38 v29.9,2.26 | 14.88,19.91 14.68,19.91 14.24,19.48 U3.10 | 14.88,19.91 14.94,19.97 v14.94,20.75 | U2.1 17.23,33.54 16.46,34.31 15.37,34.31 15.01,33.96 15.01,30.89 15.44,30.89 v19.76,26.57 | R14.1 18.06,14.6 18.84,13.82 18.84,12.63 18.7,12.49 18.51,12.49 17.53,11.51 | v28.4,31.24 29.31,32.16 v29.31,33.5 | v36.61,33.81 36.34,33.54 U2.39 | v19.76,26.57 19.28,26.57 v16.76,29.08 | C12.1 23.46,21.9 C9.2 | C12.1 22.36,22.99 20.06,22.99 v20.03,23.02 | v15.49,4.29 15.49,5.74 v15.62,5.87 | 13.74,3.72 14.29,3.17 v16.41,3.17 16.41,2.68 16.52,2.57 16.52,2.06 16.16,1.71 9.4,1.71 8.97,2.14 7.01,2.14 v6.96,2.09 | C2.2 10.06,2.87 9.37,3.56 9.68,3.86 9.68,4.7 v9.78,4.8
  Top 0.203: 35.56,33.54 v36.59,32.52
  Top 0.254: R7.2 33.58,17.11 v34.94,17.11 | C18.1 34.79,18.39 v34.83,18.34 | U3.1 v7.13,18.59 | SW1.B1 27.96,6.83 v27.96,5.31 | 13.74,3.72 C23.2
  Top 0.305: U2.39 35.56,33.54 | v28.4,31.24 28.13,31.24 U2.1
  Bottom 0.152: v28.27,20.3 26.5,20.3 v26.24,20.55 23.52,23.27 20.29,23.27 v20.03,23.02 | v14.94,22.76 14.94,23.62 v14.58,23.98 | v11.08,9.51 11.35,9.51 C20.2 12.7,8.72 14.19,7.24 v14.91,7.24 15.62,6.53 v15.62,5.87 | v19.76,26.57 21.16,25.17 v22.81,25.17 | v32.64,12.17 30.91,12.17 SD2.6 30.36,12.72 29.63,12.72 29.5,12.85 29.5,14.84 29.63,14.98 33.06,14.98 SD2.MT1 34.94,16.86 v34.94,17.11 34.94,18.23 v34.83,18.34 34.7,18.21 v28.98,18.21 | v29.9,2.26 34.11,2.26 SD2.MT2 | v11.68,16.54 9.19,16.54 v7.13,18.59 | v29.31,33.5 36.3,33.5 v36.61,33.81 | USB2.5 4.98,7.6 5.64,8.26 5.64,8.54 v5.96,8.87 5.96,10.6 5.13,11.43 5.13,11.94 5.49,12.29 6.1,12.29 v6.49,12.68 | v12.93,20.45 14.63,20.45 v14.94,20.75 | v16.41,3.17 14.74,3.17 C6.2 15.49,3.92 v15.49,4.29 15.19,4.6 13.21,4.6 12.71,5.11 CHRG2.2 10.08,5.11 v9.78,4.8 | v6.36,4.65 6.46,4.55 C5.1 6.46,2.56 6.94,2.09 v6.96,2.09 | LDO2.2 8.27,10.26 8.27,10.71 v8.04,10.94
  pour Bottom (isolate 0.305): 0.21,32.99 37.74,32.99 37.74,0.24 0.21,0.24
LED1  (via drill 0.35)
  Top 0.152: v33.63,27.3 34.07,27.74 U2.31 | R3.2 v16.61,26.26
  Bottom 0.152: v33.63,27.3 30.09,27.3 29.66,27.73 27.12,27.73 25.65,26.26 21.34,26.26 20.42,27.18 17.3,27.18 16.61,26.49 v16.61,26.26
LED2  (via drill 0.35)
  Top 0.152: R4.2 16.61,27.76 v16.64,27.74 | v33.63,28.37 33.63,28.53 34.24,29.14 U2.33
  Bottom 0.152: v16.64,27.74 16.87,27.51 26.47,27.51 27,28.04 33.3,28.04 v33.63,28.37
MISO  (via drill 0.35)
  Top 0.152: U2.28 35.72,25.64 36.91,24.46 36.91,13.59 36.43,13.11 v35.11,13.11
  Bottom 0.152: v35.11,13.11 30.67,13.11 SD2.7
MOSI  (via drill 0.35)
  Top 0.152: U3.19 20.55,17.15 v20.78,16.92 | v33.24,24.43 33.75,24.94 U2.27
  Bottom 0.152: v20.78,16.92 21.47,16.92 29.49,8.9 SD2.3 33.78,8.9 35.71,10.83 35.71,18.5 35.21,19 33.48,19 31.49,20.98 31.49,23.85 31.82,24.18 32.58,24.18 32.83,24.43 v33.24,24.43
N$1
  Top 0.152: U3.11 14.95,16.76 R6.2
N$2
  Top 0.254: R7.1 31.81,17.09 29.71,14.99 26.8,14.99 25.43,16.36 25.43,18.57 U3.26
N$3
  Top 0.254: U3.2 8.65,20.91 C13.2
N$4
  Top 0.152: U2.13 26.93,20.24 26.64,19.95 22.7,19.95 22.1,20.55 C8.2 20.38,20.83 XTAL2.P$1
N$5
  Top 0.254: U3.3 9.35,21.56 9.38,21.52 C13.1
N$6
  Top 0.152: U2.14 27.66,22.13 27.4,22.39 27.4,22.99 27.26,23.12 25.89,23.12 25.76,22.99 25.76,22.66 25.06,21.96 25.06,21.38 | XTAL2.P$2 21.54,22.37 21.54,21.83 22.86,20.51 24.19,20.51 25.06,21.38 | 25.06,21.38 C9.1
N$7
  Top 0.254: U3.4 10.05,21.24 C15.2
N$8
  Top 0.254: U3.5 10.75,20.64 C15.1
N$9
  Top 0.152: LED3.A 13.55,26.21 R3.1
N$10
  Top 0.152: LED4.A 13.68,29.03 R4.1
N$11
  Top 0.152: 24.24,24.94 U2.10
  Top 0.305: L2.1 24.24,24.94
N$12
  Top 0.152: C7.1 24.11,26.61 L2.2 24.25,26.55 24.93,25.88 25.6,25.88 U2.9
N$13
  Top 0.254: C16.2 31.05,18.85 30.38,18.85 30.2,18.67 30.2,16.98 29.24,16.03 27.76,16.03 26.85,16.94 U3.28
N$15
  Top 0.254: U3.27 26.13,18.6 26.13,16.82 27.46,15.49 29.41,15.49 30.68,16.77 30.68,18.21 30.86,18.39 C18.2
N$17  (via drill 0.35)
  Top 0.152: v17.04,5.49 17.97,5.49 R11.2
  Bottom 0.152: v17.04,5.49 16.79,5.23 15.36,5.23 12.74,7.84 10.28,7.84 10.08,8.04 9.29,8.04 8.38,7.12 CHRG2.5
N$19
  Top 0.152: XTAL3.P$1 18.54,23.33 18.54,24.71 18.56,24.73 U4.2
N$20
  Top 0.152: U4.1 16.02,22.79 XTAL3.P$2
N$23
  Top 0.152: U5.12 10.48,7 12.1,8.62 R17.2
N$24
  Top 0.152: U5.11 9.92,5.8 12,3.72 R18.2
N$25
  Top 0.152: LED5.C 13.77,11.92 R19.2
N$26
  Top 0.152: R20.2 3.21,3.96 5.17,3.96 LED6.C
RESET  (via drill 0.35)
  Top 0.152: CORTEX1.10 3.2,25.86 3.54,25.52 4.35,24.71 | v31.22,29.64 33.01,29.64 33.91,30.54 U2.35 | v5.97,24.79 5.97,23.3 C14.2
  Top 0.203: C14.2 4.42,23.15 R5.1 | D1.+ 4.35,24.71 4.35,23.26 R5.1 | R5.1 4.33,22.1 SW4.1
  Bottom 0.152: v5.97,24.79 9.14,27.96 12.72,27.96 15.8,31.04 22.61,31.04 24.01,29.64 v31.22,29.64
RXD.FT
  Top 0.152: R9.1 6.63,15.88 3.76,13.01 3.76,10.52 3.89,10.39 4.34,10.39 U5.4
RXD.NRF  (via drill 0.35)
  Top 0.152: U2.21 32.55,22.12 32.55,24.56 v32.33,24.79 | v13.49,13.89 13.13,13.54 R8.2
  Bottom 0.152: v32.33,24.79 31.87,25.25 31.82,25.3 31.45,25.3 30.87,25.87 26.99,25.87 26.16,25.04 24.41,25.04 24.33,24.97 24.33,24.54 23.41,23.62 18.24,23.62 18.01,23.39 18.01,21.12 18.75,20.38 18.75,17.59 19.01,17.32 19.01,15.74 19.43,15.32 22.63,15.32 22.68,15.27 22.68,11.43 20.62,11.43 18.79,13.26 13.49,13.26 v13.49,13.89
RXLED
  Top 0.152: R19.1 12.39,10.17 U5.17
SCK  (via drill 0.35)
  Top 0.152: v19.87,16.89 19.85,16.91 U3.18 | U2.26 36.58,24.24 36.58,15.79 34.47,13.69 34.47,12.5 35.13,11.85 35.13,11.58 v34.62,11.07
  Bottom 0.152: v19.87,16.89 19.87,17.17 20.3,17.6 22.28,17.6 28.78,11.1 SD2.5 30.5,11.07 v34.62,11.07
SCL
  Top 0.152: U4.6 20.5,30.62 19.58,31.54 | 19.58,31.54 R2.1 | 19.58,31.54 20.2,31.54 21.06,32.4 25.84,32.4 27.58,30.66 27.58,29.92 25.91,29.92 U2.3
SDA
  Top 0.152: R1.1 U4.5 22.5,30.76 24.6,30.76 24.82,30.54 U2.2
SWCLK  (via drill 0.35)
  Top 0.152: v36.61,30.66 36.02,31.24 U2.36
  Bottom 0.152: CORTEX1.4 7.77,28.68 12.4,28.68 16.16,32.44 34.83,32.44 v36.61,30.66
SWDIO  (via drill 0.35)
  Top 0.152: v36.61,31.61 36.02,31.61 35.92,31.71 35.26,31.71 U2.37
  Bottom 0.152: CORTEX1.2 9.09,30.25 13.21,30.25 15.83,32.87 35.31,32.87 36.56,31.61 v36.61,31.61
SWO  (via drill 0.35)
  Top 0.152: v36.61,27.76 35.92,28.44 U2.32
  Bottom 0.152: v36.61,27.76 36.61,29.69 34.17,32.13 16.46,32.13 12.6,28.27 6.91,28.27 CORTEX1.6
TXD.FT
  Top 0.152: U5.20 10.66,12.81 R8.1
TXD.NRF  (via drill 0.35)
  Top 0.152: U2.19 31.13,25.33 v31.7,25.9 | v10.24,15.82 8.75,15.82 R9.2
  Bottom 0.152: v31.7,25.9 31.42,26.18 26.86,26.18 26.03,25.35 24.13,25.35 24.03,25.25 24.03,24.67 23.29,23.93 17.91,23.93 17.7,23.72 17.7,20.99 18.44,20.26 18.44,17.14 12.6,17.14 12.29,16.84 12.29,16.28 11.83,15.82 v10.24,15.82
TXLED
  Top 0.152: R20.1 3.85,5.65 U5.10
USB+  (via drill 0.35)
  Top 0.152: C23.1 12.29,5.42 | 12.29,5.42 R18.1 | v19.3,10.95 19.3,6.1 19.17,5.97 17.43,5.97 16.82,6.58 14.59,6.58 14.16,6.14 13.02,6.14 12.29,5.42
  Bottom 0.152: USB2.3 4.61,6.52 3.89,6.52 3.57,6.84 3.57,11.63 | v19.3,10.95 19.3,12.24 18.62,12.92 12.17,12.92 9.88,15.21 7.76,15.21 4.13,11.58 3.62,11.58 3.57,11.63 | 3.57,11.63 3.57,11.78 v2.98,12.37
USB-  (via drill 0.35)
  Top 0.152: R17.1 C24.2 13.09,6.45 11.79,6.45 11.36,6.02 11.36,4.83 11.55,4.64 14.29,4.64 15.24,3.69 15.74,3.69 16.4,4.34 17.14,4.34 17.14,1.8 17.05,1.71 16.75,1.41 6.76,1.41 v6.04,2.12
  Bottom 0.152: USB2.2 4.61,5.43 3.89,5.43 3.75,5.29 3.75,4.71 3.98,4.48 5.5,4.48 5.64,4.34 5.64,2.53 v6.04,2.12
V_USB  (via drill 0.35)
  Top 0.152: U5.15 8.1,8.9 v6.66,10.34
  Bottom 0.152: v6.66,10.34 6.66,11.16 | USB2.1 5.05,5.22 5.78,5.22 5.92,5.37 5.92,7.9
  Bottom 0.203: v6.66,10.34 7.01,9.98 7.01,8.99 5.92,7.9 | 6.66,11.16 D5.+
VIN  (via drill 0.35)
  Top 0.152: C21.2 14.82,12.65 11.8,12.65 11.31,12.17 v11.31,10.88
  Bottom 0.152: LDO2.1 7.76,9.28 8.24,8.8 9.37,8.8 9.37,9.52 LDO2.3 | LDO2.1 7.32,10.25 7.32,11.47 7.62,11.77 8.38,11.77 D5.- 10.87,11.18 | CHRG2.4 8.22,4.16 6.88,5.5 6.23,5.5 6.23,7.64 7.76,9.17 LDO2.1 | 10.87,11.18 11.02,11.18 v11.31,10.88 | 10.87,11.18 11.51,11.82 D4.- | R12.2 8.87,3.36 8.87,3.67 CHRG2.4 | C5.2 8.16,3.94 CHRG2.4
VLIPO  (via drill 0.35)
  Top 0.152: v9.63,14.61 9.7,14.68 16.22,14.68 R13.2 | v5.74,11.68 5.88,11.55 5.88,10.26 6.41,9.73 6.83,9.73 7.97,8.6 8.12,8.6 v8.12,5.2
  Top 0.203: v4.98,13.34 5,13.36 v7.98,13.36
  Bottom 0.152: D4.+ 9.21,14.19 v9.63,14.61 | CHRG2.3 9.58,4.16 9.07,4.66 8.68,4.66 v8.13,5.21 v8.12,5.2 8.19,5.2 8.52,5.53 9.18,5.53 10.68,7.02 C20.1 | 8.63,12.54 7.21,12.54 6.65,11.99 6.04,11.99 v5.74,11.68
  Bottom 0.203: D4.+ 8.63,12.54 7.98,13.2 v7.98,13.36 | v4.98,13.34 3.83,13.34 J2.2